# EAGLE design Probatio_Pogo (EAGLE 8.2.1)
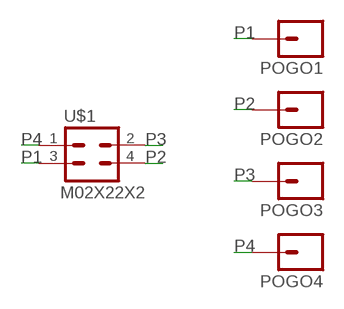
[diagram p0: schematic, sheet 1]

## Parts
POGO1  POGO_PIN0900-0-15-20-76-14-11-0  [POGO_PIN]
POGO2  POGO_PIN0900-0-15-20-76-14-11-0  [POGO_PIN]
POGO3  POGO_PIN0900-0-15-20-76-14-11-0  [POGO_PIN]
POGO4  POGO_PIN0900-0-15-20-76-14-11-0  [POGO_PIN]
U$1  M02X22X2  [2X2]

## Nets
P1: POGO1.P$1 U$1.3
P2: POGO2.P$1 U$1.4
P3: POGO3.P$1 U$1.2
P4: POGO4.P$1 U$1.1

## Library data of the parts
POGO1-POGO4 = Batebit:POGO_PIN
U$1 = Batebit:M02X2

## Net classes
0 default: width 0.4 mm, drill 0.8 mm, clearance 0.2 mm

## Board
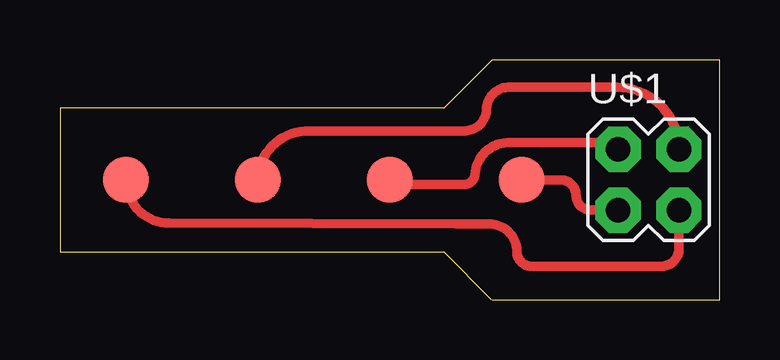
[diagram p1: board, top side]

Size 27.5 x 10 mm. Coordinates in mm from the lower left corner, seen from the top.
Outline: 18,0 27.5,0 27.5,10 18,10 16,8 0,8 0,2 16,2 17.99,0
Copper layers (1*16): Top 0.035mm / dielectric 1.5mm / Bottom 0.035mm
Design rules "default": minimum track width 6mil, minimum drill 0.35mm, track to track 6mil, track to pad 6mil, pad to pad 6mil, via to via 6mil, smd to smd 6mil, copper to edge 40mil, drill to drill 6mil, minimum pad ring 10mil, minimum via ring 8mil, stop-mask expansion 4mil, vias tented up to drill 0mil, thermal gap 10mil

### Footprints (pad centres in the part's own frame; a part is rotated, then mirrored left to right if it is on the bottom)
POGO_PIN = smd 1.9 x 1.9: P$1 0,0
2X2 = drill 1.016 pad 1.88 octagon: 1 -1.27,-1.27; 2 -1.27,1.27; 3 1.27,-1.27; 4 1.27,1.27

### Placement (x,y rotation side)
POGO1  2.75,5 0 top
POGO2  8.25,5 0 top
POGO3  13.75,5 0 top
POGO4  19.25,5 0 top
U$1  24.54,5 0 top

### Tracks (layer width: path | path; a pad name or v marks a point on that pad's centre or on a via)
P1
  Top 0.4: POGO1.P$1 arc90 4.56,3.19 16.51,3.16 | U$1.3 25.81,2.12 arc-90 25.08,1.39 19.66,1.39 arc-90 19.05,2 arc90 17.89,3.16 16.51,3.16 | 16.51,3.16 16.86,3.16
P2
  Top 0.4: POGO2.P$1 arc-90 10.41,7.04 16.82,7.04 arc90 17.78,7.91 arc-90 18.74,8.87 19.4,8.87 23.22,8.86 arc-90 U$1.4
P3
  Top 0.4: POGO3.P$1 arc90 13.77,4.98 arc90 14.13,4.8 16.8,4.8 arc90 17.3,5.22 arc-90 18.78,6.55 22.99,6.55 arc-90 U$1.2
P4
  Top 0.4: POGO4.P$1 20.87,5 arc-90 21.52,4.35 arc90 22.14,3.73 U$1.1